# Altium schematic sheet alimentation.SchDoc
size A4; SheetNumber: 10; SheetTotal: 11
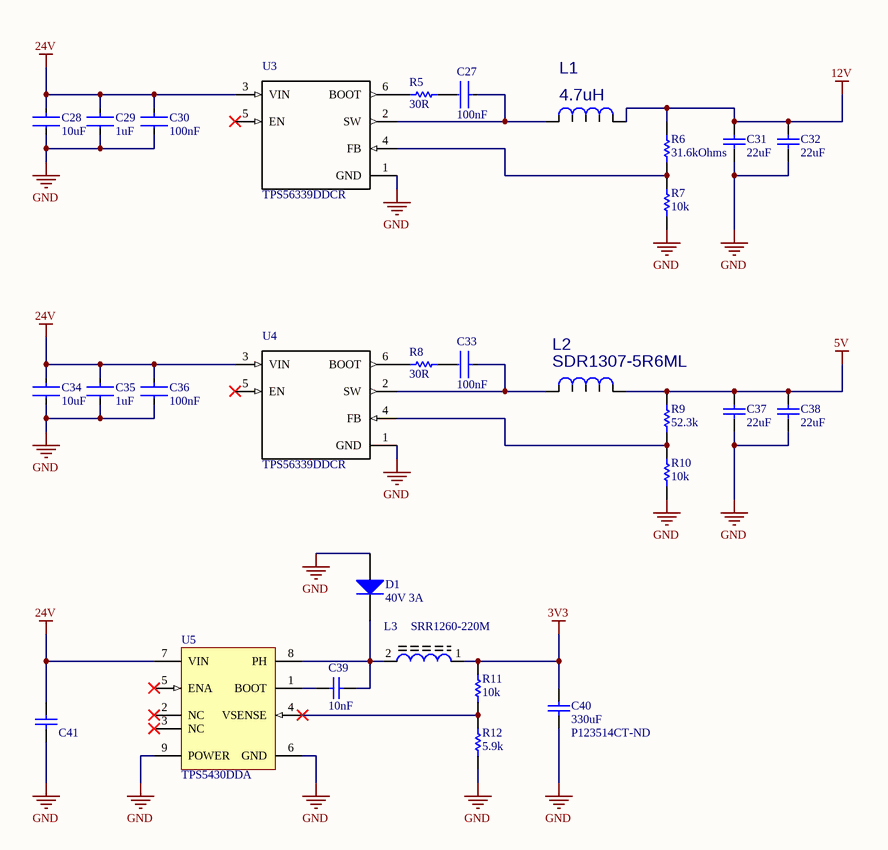
[diagram p0: alimentation.SchDoc]

## Parts
C27  100nF  [FP-GRM155-0_15-MFG]
C28  10uF  [FP-GRM155-0_15-MFG]
C29  1uF  [FP-GRM155-0_15-MFG]
C30  100nF  [FP-GRM155-0_15-MFG]
C31  22uF  [CAPC0805(2012)145_M]
C32  22uF  [CAPC0805(2012)145_M]
C33  100nF  [FP-GRM155-0_15-MFG]
C34  10uF  [FP-GRM155-0_15-MFG]
C35  1uF  [FP-GRM155-0_15-MFG]
C36  100nF  [FP-GRM155-0_15-MFG]
C37  22uF  [CAPC0805(2012)145_M]
C38  22uF  [CAPC0805(2012)145_M]
C39  10nF  [CAPC2013X70X50ML10T25]
C40  330uF  Supplier Part Number 1: P123514CT-ND  [CAP_TPE_D3L]
C41  CAP 10uF 50V 1206(3216)  [CS-1206]  (value not drawn)
D1  40V 3A  [DIODE_SCHOTTKY_SMB]
L1  4.7uH  [IHLP2525EZER4R7M01]
L2  SDR1307-5R6ML  [IND_BOURNS_SDR13]
L3  SRR1260-220M  [*INDP125125X600N]
R5  30R  [RESC0805(2012)_N]
R6  31.6kOhms  [CS-1206]
R7  10k  [RESC1206(3216)_L]
R8  30R  [RESC0805(2012)_N]
R9  52.3k  [RESC1609X50X30LL10T20]
R10  10k  [RESC1206(3216)_L]
R11  10k  [RESC1206(3216)_L]
R12  5.9k  [RESC1005X40X25LL05T05]
U3  TPS56339DDCR  [*SOT95P280X110-6N]
U4  TPS56339DDCR  [*SOT95P280X110-6N]
U5  TPS5430DDA  [DDA0008J_M]

## Nets
3V3: C40.2 L3.1 R11.2
5V: C37.2 C38.2 L2.1 R9.2
12V: C31.2 C32.2 L1.1 R6.2
24V: C28.1 C29.1 C30.1 C34.1 C35.1 C36.1 C41.2 U3.3(VIN) U4.3(VIN) U5.7(VIN)
GND: C28.2 C29.2 C30.2 C31.1 C32.1 C34.2 C35.2 C36.2 C37.1 C38.1 C40.1 C41.1 D1.1(A) R7.1 R10.1 R12.1 U3.1(GND) U4.1(GND) U5.6(GND) U5.9(POWER)
NetC27_1: C27.1 L1.2 U3.2(SW)
NetC27_2: C27.2 R5.2
NetC33_1: C33.1 L2.2 U4.2(SW)
NetC33_2: C33.2 R8.2
NetC39_1: C39.1 U5.1(BOOT)
NetC39_2: C39.2 D1.2(K) L3.2 U5.8(PH)
NetR5_1: R5.1 U3.6(BOOT)
NetR6_1: R6.1 R7.2 U3.4(FB)
NetR8_1: R8.1 U4.6(BOOT)
NetR9_1: R9.1 R10.2 U4.4(FB)
NetR11_1: R11.1 R12.2 U5.4(VSENSE)

Not connected (* = marked no-connect by the designer): U3 5(EN)*; U4 5(EN)*; U5 2(NC)* 3(NC)* 5(ENA)*

## Library data of the parts
C27 C30 C33 C36 = CL05A104KA5NNNC: Multilayer Ceramic Capacitor, 0.1 uF, 25 V, ± 10%, X5R, 0402 [1005 Metric]; Manufacturer: Samsung; Material: 4241ConductorMaterial; Voltage Rating: 25V; Supplier: Digikey; Supplier Part Number: 1276-1043-1-ND; Manufacturer Part Number: CL05A104KA5NNNC; RoHS: Yes; Category: Ceramic Capacitors; Stock: 11930039; Pricing: 1=0.1, 10=0.01, 50=0.0054, 100=0.0042, 500=0.00318, 1000=0.0025, 2500=0.00227, 5000=0.00209 (USD); Mounting Technology: Surface Mount; Case/Package: 0402; Case Code (Metric): 1005; Case Code (Imperial): 0402; Min Operating Temperature: -55°C; Max Operating Temperature: 85°C; Value: 100nF; Packaging: Tape and Reel; Tolerance: 10%; Dielectric: X5R; Voltage: 25V; Series: CL; Construction: Flat; Package Quantity: 1; Voltage Rating (DC): 25V; Length: 1mm; Width: 0.02inch; Height: 0.5mm; Depth: 0.5mm; Thickness: 0.022inch; Radiation Hardening: No; RoHS Compliant: Yes; Lead Free: Lead Free; ComponentLink1URL: https://datasheet.ciiva.com/25802/cl05a104ka5nnnc-25802704.pdf?src-supplier=Digikey; ComponentLink1Description: https://datasheet.ciiva.com/25802/cl05a104ka5nnnc-25802704.pdf?src-supplier=Digikey; ComponentLink2URL: https://datasheet.ciiva.com/16437/cl05a104ka5nnnc-16437369.pdf?src-supplier=Future+Electronics; ComponentLink2Description: https://datasheet.ciiva.com/16437/cl05a104ka5nnnc-16437369.pdf?src-supplier=Future+Electronics; ComponentLink3URL: https://datasheet.ciiva.com/26838/getdatasheetpartid-357412-26838142.pdf?src-supplier=Verical; ComponentLink3Description: https://datasheet.ciiva.com/26838/getdatasheetpartid-357412-26838142.pdf?src-supplier=Verical; ComponentLink4URL: https://datasheet.ciiva.com/26309/mlcc-catalogdownload2013-eng-26309014.pdf?src-supplier=Distrelec; ComponentLink4Description: https://datasheet.ciiva.com/26309/mlcc-catalogdownload2013-eng-26309014.pdf?src-supplier=Distrelec
C28 C34 = GRM155R60J106ME15D: Multilayer Ceramic Capacitor, 10 uF, 6.3 V, ± 20%, X5R, 0402 [1005 Metric]; Manufacturer: Murata; Material: 4241ConductorMaterial; Voltage Rating: 6.3V; Supplier: Digikey; Supplier Part Number: 490-13238-1-ND; Manufacturer Part Number: GRM155R60J106ME15D; RoHS: Yes; Category: Ceramic Capacitors; Stock: 6215687; Pricing: 1=0.17, 10=0.11, 50=0.0696, 100=0.0557, 500=0.04022, 1000=0.03558, 2500=0.03404, 5000=0.03094 (USD); Mounting Technology: Surface Mount; Case/Package: 0402; Case Code (Metric): 1005; Case Code (Imperial): 0402; Min Operating Temperature: -55°C; Max Operating Temperature: 85°C; Packaging: Cut Tape; Value: 10uF; Tolerance: 20%; Voltage Rating (DC): 6.3V; Dielectric: X5R; Series: GRM; Length: 0.039inch; Width: 0.02inch; Height: 650um; Thickness: 0.026inch; RoHS Compliant: Yes; ComponentLink1URL: https://datasheet.octopart.com/GRM155R60J106ME15D-Murata-datasheet-149522992.pdf?src-supplier=Newark; ComponentLink1Description: https://datasheet.octopart.com/GRM155R60J106ME15D-Murata-datasheet-149522992.pdf?src-supplier=Newark; ComponentLink2URL: https://www.murata.com/~/media/webrenewal/support/library/catalog/products/capacitor/mlcc/c02e.ashx?la=en-us&src-supplier=Digikey; ComponentLink2Description: https://www.murata.com/~/media/webrenewal/support/library/catalog/products/capacitor/mlcc/c02e.ashx?la=en-us&src-supplier=Digikey; ComponentLink3URL: https://datasheet.octopart.com/GRM155R60J106ME15D-Murata-datasheet-165579666.pdf?src-supplier=TME; ComponentLink3Description: https://datasheet.octopart.com/GRM155R60J106ME15D-Murata-datasheet-165579666.pdf?src-supplier=TME
C29 C35 = GRM155R61E105MA12D: Multilayer Ceramic Capacitor, 1 uF, 25 V, ± 20%, X5R, 0402 [1005 Metric]; Manufacturer: Murata; Voltage Rating: 25V; Supplier: Digikey; Supplier Part Number: 490-10018-1-ND; Manufacturer Part Number: GRM155R61E105MA12D; RoHS: Yes; Category: Ceramic Capacitors; Stock: 2496490; Pricing: 1=0.1, 10=0.066, 50=0.0376, 100=0.0292, 500=0.022, 1000=0.01728, 2500=0.01571, 5000=0.01445 (USD); Mounting Technology: Surface Mount; Case/Package: 0402; Case Code (Metric): 1005; Case Code (Imperial): 0402; Weight: 0.000212oz; Min Operating Temperature: -55°C; Max Operating Temperature: 85°C; Value: 1uF; Packaging: Tape and Reel; Tolerance: 20%; Dielectric: X5R; Termination: SMD/SMT; Voltage Rating (DC): 25V; Package Quantity: 10000; Series: GRM; Length: 0.039inch; Width: 0.02inch; Height: 0.5mm; Thickness: 0.022inch; RoHS Compliant: Yes; ComponentLink1URL: http://www.mouser.com/ds/2/281/c02e-2905.pdf?src-supplier=Mouser; ComponentLink1Description: http://www.mouser.com/ds/2/281/c02e-2905.pdf?src-supplier=Mouser; ComponentLink2URL: https://datasheet.octopart.com/GRM155R61E105MA12D-Murata-datasheet-149523023.pdf?src-supplier=Newark; ComponentLink2Description: https://datasheet.octopart.com/GRM155R61E105MA12D-Murata-datasheet-149523023.pdf?src-supplier=Newark; ComponentLink3URL: https://datasheet.octopart.com/GRM155R61E105MA12D-Murata-datasheet-22122223.pdf?src-supplier=Future+Electronics; ComponentLink3Description: https://datasheet.octopart.com/GRM155R61E105MA12D-Murata-datasheet-22122223.pdf?src-supplier=Future+Electronics; ComponentLink4URL: http://search.murata.co.jp/Ceramy/image/img/A01X/G101/ENG/GRM155R61E105MA12-01.pdf?src-supplier=Digikey; ComponentLink4Description: http://search.murata.co.jp/Ceramy/image/img/A01X/G101/ENG/GRM155R61E105MA12-01.pdf?src-supplier=Digikey
C31 C32 C37 C38 = CMP-1036-04945-1: CAP 22uF 16V ±10% 0805 (2012 Metric) Thickness 1.45mm SMD; Case-EIA: 0805; Tolerance: Â±10%; Case-Metric: 2012; Technology: SMT; Max Thickness: 1.45 mm; Rated Voltage: 16 V; Value: 22uF
C39 = CMP-2000-05000-1: CAP, Ceramic, 10 nF, +/- 10%, 50 V, -55 to 125 degC, 0805 (2012 Metric), RoHS, Tape and Reel; Manufacturer: Yageo; Other Names: 311-1136-6; Capacitance: 10000pF; Temperature Coefficient: X7R; Catalog Drawings: CC_0805_0.6; Featured Product: CommodityMultilayerCeramicCapacitors–CCSeries; Online Catalog: CCSeries; Product Training Modules: MultilayerCeramicCapacitors; Voltage - Rated: 50V; Packaging: Digi-Reel; Height - Seated (Max): -; Tolerance: ±10%; Applications: GeneralPurpose; Features: -; Datasheet Version: Rev. 2, 05/2009; Mounting Type: SurfaceMount,MLCC; Ratings: -; Lead Style: -; Manufacturer URL: http://www.yageo.com/; Package / Case: 0805(2012Metric); Operating Temperature: -55degC~125degC; Standard Package: 1; Package Description: 2-Pin Surface Mount Device, Body 2 x 1.25 mm; Datasheet URL: https://datasheet.ciiva.com/11786/0900766b80d84f1d-11786119.pdf; Lead Spacing: -; Series: CC; Category: Capacitors; Family: CeramicCapacitors; Package Reference: 0805 (2012 Metric)
C40 = 6TPE330MAL: Cap Tant Polymer 330uF 6.3VDC D3L CASE 20% (7.3 X 4.3 X 2.8mm) SMD 7343 0.025 Ohm 105C Embossed T/R; Manufacturer 1: Panasonic; Voltage Rating: 6.3V; ESR (Equivalent Series Resistance): 25mR; Ripple Current: 2.4A; Leakage Current: 207.9uA; Polarity: Polar; Dissipation Factor: 10%; Supplier 1: Digi-Key; Manufacturer Part Number 1: 6TPE330MAL; Stock 1: 2448; Pricing 1: 1=1.54000, 10=1.21400, 100=0.91080, 500=0.68816, 1000=0.60720 (USD); RoHS: Yes; Mount: Surface Mount; Case/Package: 2917; Case Code (Metric): 7343; Case Code (Imperial): 2917; Min Operating Temperature: -55°C; Max Operating Temperature: 105°C; Package Quantity: 2500; Packaging: Tape and Reel; Capacitance: 330uF; Tolerance: 20%; Voltage Rating (DC): 6.3V; Termination: SMD/SMT; Voltage: 6.3V; Features: General Purpose; Length: 7.3mm; Height: 2.8mm; Width: 0.169inch; Height - Seated (Max): 0.118inch; Depth: 4.3mm; Radiation Hardening: No; REACH SVHC: No SVHC; Lead Free: Lead Free; ComponentLink1URL: https://datasheet.ciiva.com/22745/1734363-22745356.pdf?src-supplier=Element14; ComponentLink1Description: https://datasheet.ciiva.com/22745/1734363-22745356.pdf?src-supplier=Element14; ComponentLink2URL: https://datasheet.ciiva.com/25785/1734363-25785996.pdf?src-supplier=Farnell; ComponentLink2Description: https://datasheet.ciiva.com/25785/1734363-25785996.pdf?src-supplier=Farnell
C41 = CMP-1037-04982-1: CAP 10uF 50V ±10% 1206 (3216 Metric) Thickness 1.9mm SMD; Manufacturer: TDK; Manufacturer Part Number: C3216X5R1H106K; Case-EIA: 1206; Tolerance: Â±10%; Case-Metric: 3216; Technology: SMT; Max Thickness: 1.9 mm; Value: 10uF; Rated Voltage: 50 V
D1 = B340B-13-F: DIODE SCHOTTKY 40V 3A SMB; Manufacturer 1: Diodes; Element Configuration: Single; Peak Reverse Current: 500uA; Forward Voltage: 500mV; Peak Non-Repetitive Surge Current: 100A; Polarity: Standard; Capacitance: 250pF; Supplier 1: Digi-Key; Manufacturer Part Number 1: B340B-13-F; Stock 1: 44365; Pricing 1: 1=0.48000, 10=0.39100, 100=0.26620, 500=0.19968, 1000=0.14976 (USD); RoHS: Yes; Mount: Surface Mount; Case/Package: SMB; Number of Pins: 2; Weight: 0.00328oz; Min Operating Temperature: -55°C; Max Operating Temperature: 150°C; Forward Current: 3A; Max Repetitive Reverse Voltage (Vrrm): 40V; Packaging: Tape and Reel; Max Forward Surge Current (Ifsm): 100A; Package Quantity: 3000; Average Rectified Current: 3A; Termination: SMD/SMT; Voltage Rating (DC): 40V; Current Rating: 3A; Output Current: 3A; Max Reverse Voltage (DC): 40V; Length: 4.57mm; Height: 2.5mm; Width: 3.94mm; Radiation Hardening: No; REACH SVHC: No SVHC; Lead Free: Lead Free; ComponentLink1URL: https://datasheet.ciiva.com/26949/getdatasheetpartid-110980-26949353.pdf?src-supplier=Verical; ComponentLink1Description: https://datasheet.ciiva.com/26949/getdatasheetpartid-110980-26949353.pdf?src-supplier=Verical; ComponentLink2URL: https://datasheet.ciiva.com/25946/ds30924-25946951.pdf?src-supplier=Avnet+Europe; ComponentLink2Description: https://datasheet.ciiva.com/25946/ds30924-25946951.pdf?src-supplier=Avnet+Europe; ComponentLink3URL: https://datasheet.ciiva.com/16203/ds30924-16203765.pdf?src-supplier=Future+Electronics; ComponentLink3Description: https://datasheet.ciiva.com/16203/ds30924-16203765.pdf?src-supplier=Future+Electronics; Supplier Part Number 1: B340B-FDICT-ND
L1 = IHLP2525EZER4R7M01: FIXED IND 4.7UH 6.5A 30.3MOHM SM; Manufacturer_Part_Number: SDR1307-5R6ML; C: Copyright (C) 2015 Accelerated Designs. All rights reserved; Vendor: Bourns Electronics; Built_By: EMA_UL_Team; Supplier 1: Mouser; Supplier Part Number 1: 70-IHLP2525EZER4R7M0
L2 = SDR1307-5R6ML: C: Copyright (C) 2015 Accelerated Designs. All rights reserved; Vendor: Bourns Electronics; Built_By: EMA_UL_Team; Manufacturer_Part_Number: SDR1307-5R6ML; Value: SDR1307-5R6ML
L3 = SRR1260-220M: 22ÂµH Shielded Wirewound Inductor 4A 43mOhm Max Nonstandard; MF: Bourns; Digi-Key_Part_Number: SRR1260-220MCT-ND; Package: Nonstandard Bourns; SnapEDA_Link: https://www.snapeda.com/parts/SRR1260-220M/Bourns/view-part/290442/?ref=snap; Digi-Key_Purchase_URL: https://www.digikey.com/product-detail/en/bourns-inc/SRR1260-220M/SRR1260-220MCT-ND/2127411?utm_source=snapeda&utm_medium=aggregator&utm_campaign=symbol; MP: SRR1260-220M; Value: *
R5 R8 = CMP-1013-00336-1: 30R 0.125W 1% 0805 (2012 Metric)  SMD; Case-Metric: 2012; Value: 30.00 Ohm; Case-EIA: 0805; Power: 0.125 W; Technology: SMT; Tolerance: 1 %
R6 = RC1206FR-0731K6L: RES 31.6K OHM 1% 1/4W 1206; Manufacturer: Yageo; Manufacturer Part Number: RC0402FR-0768RL; Value: 68R; Power Rating: 63mW; Voltage Rating: 50V; Temperature Coefficient: 100ppm/°C; Supplier: Digikey; Supplier Part Number: 311-68.0LRCT-ND; RoHS: Yes; Category: Chip SMD Resistors; Stock: 982905; Pricing: 1=0.1, 10=0.015, 50=0.0088, 100=0.0073, 500=0.00488, 1000=0.00417, 5000=0.00297 (USD); Case/Package: 0402; Case Code (Metric): 1005; Case Code (Imperial): 0402; Min Operating Temperature: -55°C; Max Operating Temperature: 155°C; Tolerance: 1%; Package Quantity: 1; Packaging: Tape and Reel; Resistor Type: Thick Film; Number of Terminations: 2; Termination: SMD/SMT; Max Power Dissipation: 63mW; Features: Moisture Resistant; Series: RC; Resistance Tolerance: 1%; Construction: Rectangular; Voltage Rating (AC): 50V; Length: 0.039inch; Width: 0.02inch; Height: 0.016inch; Depth: 0.5mm; Reach SVHC Compliant: No; Military Standard: Not; Lead Free: Lead Free; RoHS Compliant: Yes; ComponentLink1URL: https://datasheet.ciiva.com/2453/pyu-r-int-thick-7-2453524.pdf?src-supplier=Digikey; ComponentLink1Description: https://datasheet.ciiva.com/2453/pyu-r-int-thick-7-2453524.pdf?src-supplier=Digikey; ComponentLink2URL: https://datasheet.ciiva.com/2453/pyu-r-int-thick-7-2453525.pdf?src-supplier=Digikey; ComponentLink2Description: https://datasheet.ciiva.com/2453/pyu-r-int-thick-7-2453525.pdf?src-supplier=Digikey; ComponentLink3URL: https://datasheet.ciiva.com/2453/pyu-r-int-thick-7-2453523.pdf?src-supplier=Digikey; ComponentLink3Description: https://datasheet.ciiva.com/2453/pyu-r-int-thick-7-2453523.pdf?src-supplier=Digikey; ComponentLink4URL: https://datasheet.ciiva.com/5558/pyu-rc0402-51-rohs-l-6-r-5558023.pdf?src-supplier=Mouser; ComponentLink4Description: https://datasheet.ciiva.com/5558/pyu-rc0402-51-rohs-l-6-r-5558023.pdf?src-supplier=Mouser; ComponentLink5URL: https://datasheet.ciiva.com/7850/1018594-7850074.pdf?src-supplier=Element14; ComponentLink5Description: https://datasheet.ciiva.com/7850/1018594-7850074.pdf?src-supplier=Element14; ComponentLink6URL: https://datasheet.ciiva.com/7850/1018594-7850075.pdf?src-supplier=Element14; ComponentLink6Description: https://datasheet.ciiva.com/7850/1018594-7850075.pdf?src-supplier=Element14; ComponentLink7URL: https://datasheet.ciiva.com/15189/getdatasheetpartid-325392-15189501.pdf?src-supplier=Verical; ComponentLink7Description: https://datasheet.ciiva.com/15189/getdatasheetpartid-325392-15189501.pdf?src-supplier=Verical; Supplier 1: Future Electronics; Supplier Part Number 1: 1163037
R7 R10 R11 = CMP-1014-00623-1: 10K 0.25W 1% 1206 (3216 Metric)  SMD; Case-Metric: 3216; Value: 10000.00 Ohm; Case-EIA: 1206; Power: 0.25 W; Technology: SMT; Tolerance: 1 %
R9 = CMP-2000-03451-1: Part Number: CRCW060352K3FKEA; Manufacturer: Vishay Dale
R12 = CMP-2002-00126-1: CRCW04025K90FKED; Manufacturer: Vishay Dale; Part Number: CRCW04025K90FKED
U3 U4 = TPS56339DDCR: BSR-MCP; MF: Texas Instruments; SnapEDA_Link: https://www.snapeda.com/parts/TPS56339DDCR/Texas%20Instruments/view-part/4178121/?ref=snap; Package: SOT-23-6 Texas Instruments; Availability: Unavailable; Price: None; MP: TPS56339DDCR; Value: *
U5 = CMP-2000-04960-1: Wide Input Range, Step-Down Converter, 5.5 to 36 V, -40 to 125 degC, 8-Pin SOIC, Pb-Free, Tape and Reel; Manufacturer: Texas Instruments; Synchronous Rectifier: No; Product Training Modules: UnderstandingSWIFTStepDownDc/DcConverters; Frequency - Switching: 500kHz; Voltage - Output: 1.23V~31V; Number of Outputs: 1; Current - Output: 3A; Dynamic Catalog: Buck(Step-Down)IC; Other Names: 296-19447-5; For Use With: TPS5430EVM-173F-ND / -TPS5430EVM-173F / 296-19640-ND / -EVALUATIONMODULEFORTPS5430 / 296-19432-ND / -EVALUATIONMODFORTPS5430-136; Voltage - Input: 5.5V~36V; Package Version: 4202561/F, 12/2011; PWM Type: VoltageMode; Output Type: Adjustable; Reference Design Library: TPS5430EVM-136:5V@3AStepDown,5.5~24Vin / TPS5430EVM-173:5V@3A,10~35Vin; Featured Product: WEBENCHDesignCenter; Type: Step-Down(Buck); Operating Temperature: -40degC~125degC; Family: PMIC-VoltageRegulators-DCDCSwitchingRegulators; Category: IntegratedCircuits(ICs); Package URL: http://www.ti.com/lit/ml/mpds092e/mpds092e.pdf; Datasheet Version: Rev. G, 02/2015; Packaging: Tube; Package Reference: DDA8-2875X2025TP; Series: SWIFT™; Manufacturer URL: http://www.ti.com/; Standard Package: 75; Supplier Device Package: 8-SOPowerPad; Mounting Type: SurfaceMount; Package Description: 8-Pin Small Outline Package, Body 4.9 x 3.9 mm, Pitch 1.27 mm; Datasheet URL: http://www.ti.com/general/docs/lit/getliterature.tsp?genericPartNumber=TPS5430&fileType=pdf